# EAGLE schematic fonte_schema (EAGLE 9.6.2)
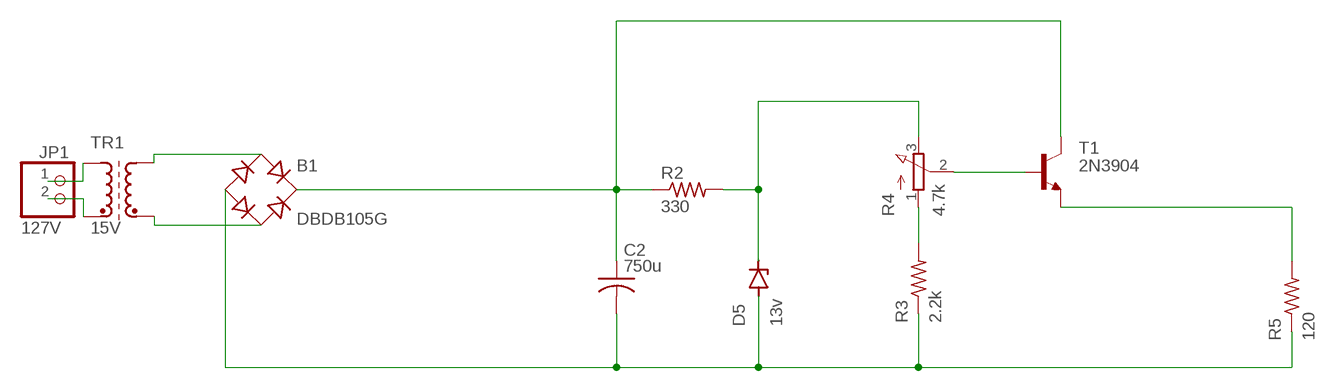
[diagram p0: schematic, sheet 1]

## Parts
B1  DBDB105G  [DB]
C2  750u  C-USC0805  [C0805]
D5  13v  ZENER-DIODEDO35Z10  [DO35Z10]
JP1  127V  PINHD-1X2  [1X02]
R2  330  R-US_R0805  [R0805]
R3  2.2k  R-US_R0805  [R0805]
R4  4.7k  3RP/1610N  [3RP/1610N]
R5  120  R-US_R0805  [R0805]
T1  2N3904  [TO92]
TR1  15V  SM-T4  [SM-T4]

## Nets
N$1: B1.- C2.2 D5.A R3.1 R5.1
N$2: B1.AC1 TR1.5(A2)
N$3: B1.+ C2.1 R2.1 T1.1(C)
N$4: D5.C R2.2 R4.3(E)
N$5: B1.AC2 TR1.4(E2)
N$6: R4.2(S) T1.2(B)
N$7: R3.2 R4.1(A)
N$8: R5.2 T1.3(E)
N$9: JP1.1 TR1.1(A1)
N$10: JP1.2 TR1.2(E1)

## Library data of the parts
B1 = rectifier:DB?*G: Single Phase 1.0 AMP Glass Passivated Bridge Rectifier Taiwan Semiconductor Co.,Ltd. - TSC Source: http://www.taiwansemi.com/TSCbig5/ezcatfiles/cust/img/img/db101g.pdf http://www.ts.com.tw/db/pictures/modules/PDT/PDT060207001/DBLS201G.pdf
C2 = rcl:C-US: CAPACITOR, American symbol; SPICEPREFIX: C
D5 = diode:ZENER-DIODE: Z-Diode; SPICEPREFIX: D
JP1 = pinhead:PINHD-1X2: PIN HEADER; SPICEPREFIX: H
R2 R3 R5 = rcl:R-US_: RESISTOR, American symbol; SPICEPREFIX: R
R4 = pot:3RP/1610N: 16mm Potentiometer one level Source: http://www.alphapotentiometers.net/html/16mm_pot_2.html; SPICEPREFIX: J
T1 = transistor:2N3904: NPN TRANSISTOR; SPICEPREFIX: J
TR1 = inductor-neosid:SM-T4: TRANSFORMER SMD wideband transformer; OC_FARNELL: unknown; OC_NEWARK: unknown; SPICEPREFIX: T